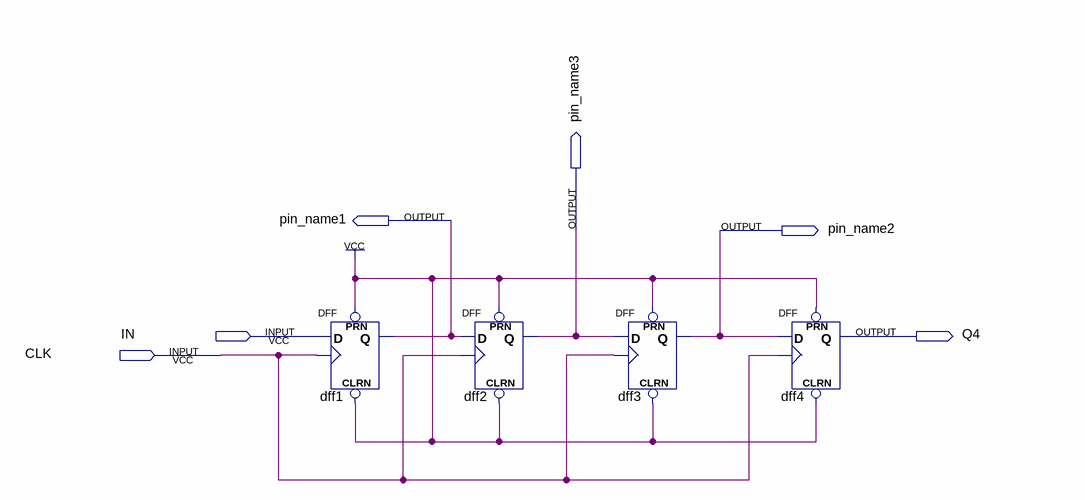
[diagram p0: schematic sheet]
// Quartus schematic lab10step1.bdf as structural Verilog: 4 symbols, 6 pins
module lab10step1 (
  input  IN,
  input  CLK,
  output pin_name1,
  output pin_name3,
  output pin_name2,
  output Q4
);

  DFF dff1 (.CLRN(1'b1), .CLK(CLK), .D(IN), .PRN(1'b1), .Q(pin_name1));
  DFF dff2 (.CLRN(1'b1), .CLK(CLK), .D(pin_name1), .PRN(1'b1), .Q(pin_name3));
  DFF dff3 (.CLRN(1'b1), .CLK(CLK), .D(pin_name3), .PRN(1'b1), .Q(pin_name2));
  DFF dff4 (.CLRN(1'b1), .CLK(CLK), .D(pin_name2), .PRN(1'b1), .Q(Q4));
endmodule
